# Altium project Accumulator_HotDog_v2.PrjPcb
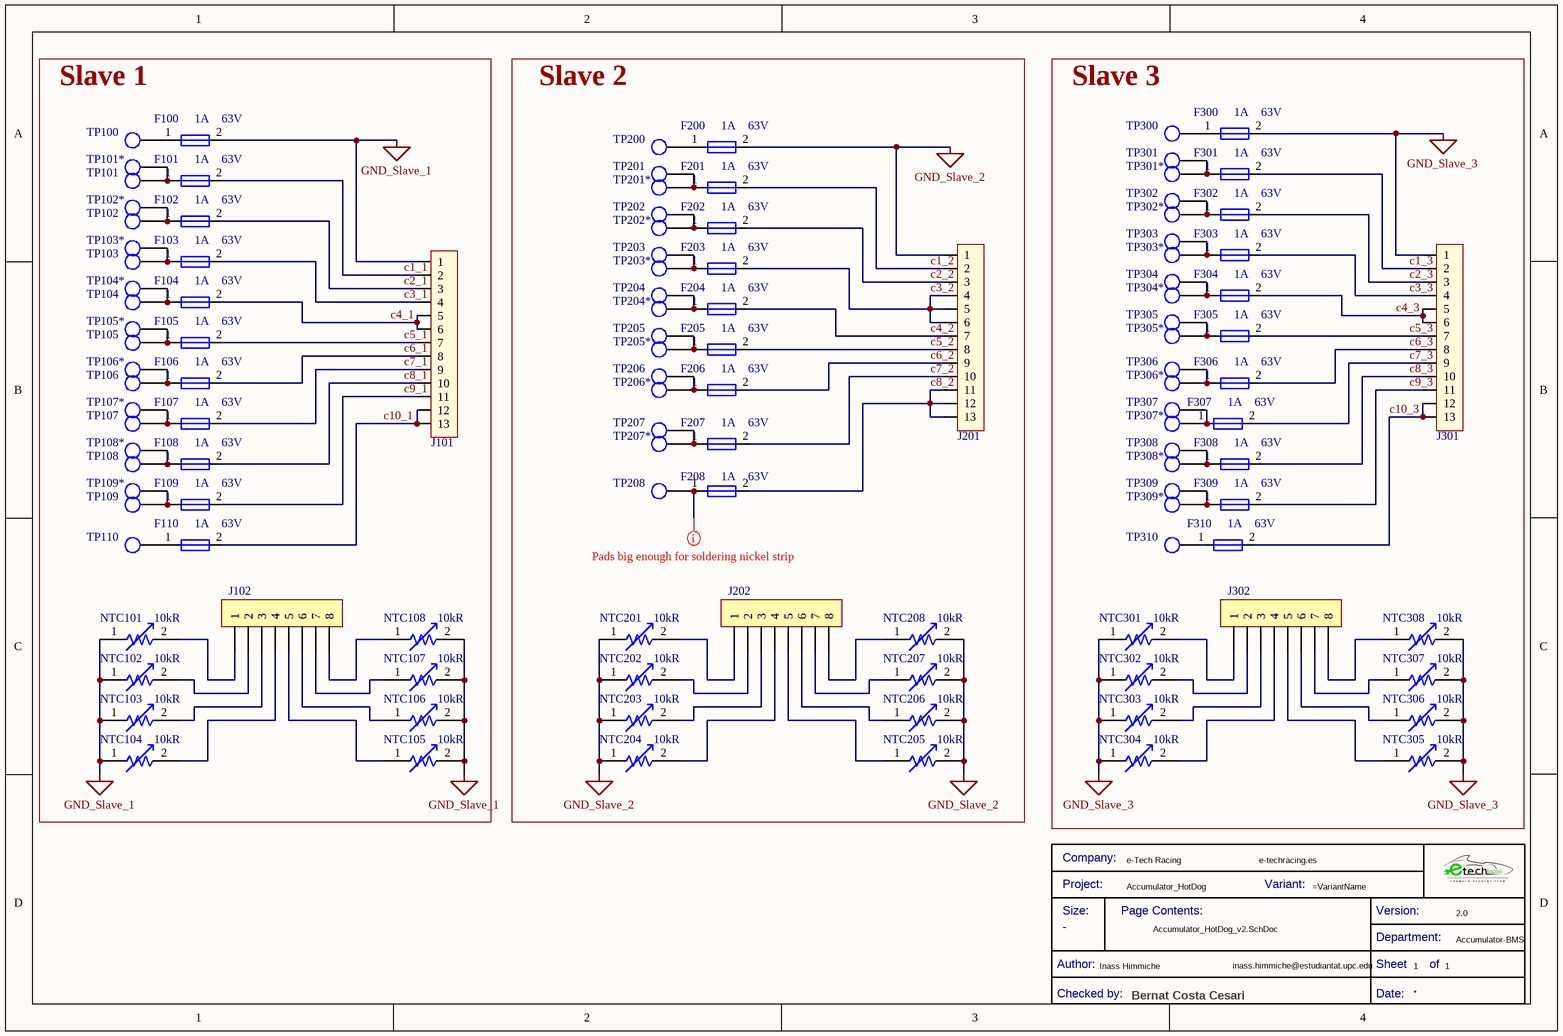
[diagram p0: Accumulator_HotDog_v2.SchDoc]
Version: 2.0; ReviewerName: Bernat Costa Cesari; Project: Accumulator_HotDog; DesignerName: Inass Himmiche; DesignerMail: inass.himmiche@estudiantat.upc.edu; DesignedByURL: e-techracing.es; Department: Accumulator-BMS; Company: e-Tech Racing
1 sheet, 118 parts. Net scope: global (net labels, ports and power ports of the same name join across sheets).
Board file: Accumulator_HotDog_v2.PcbDoc

## Sheet Accumulator_HotDog_v2.SchDoc
size A4; SheetNumber: 1; SheetTotal: 1

### Parts
*  Checked by:: Bernat Costa Cesari  (hidden comment: Title Block_template)  (graphical)
F100  Current Rating: 1A  Voltage Rating (DC): 63V  [Fuse_1206]  (hidden comment: 0437001.WRA)
F101  Current Rating: 1A  Voltage Rating (DC): 63V  [Fuse_1206]  (hidden comment: 0437001.WRA)
F102  Current Rating: 1A  Voltage Rating (DC): 63V  [Fuse_1206]  (hidden comment: 0437001.WRA)
F103  Current Rating: 1A  Voltage Rating (DC): 63V  [Fuse_1206]  (hidden comment: 0437001.WRA)
F104  Current Rating: 1A  Voltage Rating (DC): 63V  [Fuse_1206]  (hidden comment: 0437001.WRA)
F105  Current Rating: 1A  Voltage Rating (DC): 63V  [Fuse_1206]  (hidden comment: 0437001.WRA)
F106  Current Rating: 1A  Voltage Rating (DC): 63V  [Fuse_1206]  (hidden comment: 0437001.WRA)
F107  Current Rating: 1A  Voltage Rating (DC): 63V  [Fuse_1206]  (hidden comment: 0437001.WRA)
F108  Current Rating: 1A  Voltage Rating (DC): 63V  [Fuse_1206]  (hidden comment: 0437001.WRA)
F109  Current Rating: 1A  Voltage Rating (DC): 63V  [Fuse_1206]  (hidden comment: 0437001.WRA)
F110  Current Rating: 1A  Voltage Rating (DC): 63V  [Fuse_1206]  (hidden comment: 0437001.WRA)
F200  Current Rating: 1A  Voltage Rating (DC): 63V  [Fuse_1206]  (hidden comment: 0437001.WRA)
F201  Current Rating: 1A  Voltage Rating (DC): 63V  [Fuse_1206]  (hidden comment: 0437001.WRA)
F202  Current Rating: 1A  Voltage Rating (DC): 63V  [Fuse_1206]  (hidden comment: 0437001.WRA)
F203  Current Rating: 1A  Voltage Rating (DC): 63V  [Fuse_1206]  (hidden comment: 0437001.WRA)
F204  Current Rating: 1A  Voltage Rating (DC): 63V  [Fuse_1206]  (hidden comment: 0437001.WRA)
F205  Current Rating: 1A  Voltage Rating (DC): 63V  [Fuse_1206]  (hidden comment: 0437001.WRA)
F206  Current Rating: 1A  Voltage Rating (DC): 63V  [Fuse_1206]  (hidden comment: 0437001.WRA)
F207  Current Rating: 1A  Voltage Rating (DC): 63V  [Fuse_1206]  (hidden comment: 0437001.WRA)
F208  Current Rating: 1A  Voltage Rating (DC): 63V  [Fuse_1206]  (hidden comment: 0437001.WRA)
F300  Current Rating: 1A  Voltage Rating (DC): 63V  [Fuse_1206]  (hidden comment: 0437001.WRA)
F301  Current Rating: 1A  Voltage Rating (DC): 63V  [Fuse_1206]  (hidden comment: 0437001.WRA)
F302  Current Rating: 1A  Voltage Rating (DC): 63V  [Fuse_1206]  (hidden comment: 0437001.WRA)
F303  Current Rating: 1A  Voltage Rating (DC): 63V  [Fuse_1206]  (hidden comment: 0437001.WRA)
F304  Current Rating: 1A  Voltage Rating (DC): 63V  [Fuse_1206]  (hidden comment: 0437001.WRA)
F305  Current Rating: 1A  Voltage Rating (DC): 63V  [Fuse_1206]  (hidden comment: 0437001.WRA)
F306  Current Rating: 1A  Voltage Rating (DC): 63V  [Fuse_1206]  (hidden comment: 0437001.WRA)
F307  Current Rating: 1A  Voltage Rating (DC): 63V  [Fuse_1206]  (hidden comment: 0437001.WRA)
F308  Current Rating: 1A  Voltage Rating (DC): 63V  [Fuse_1206]  (hidden comment: 0437001.WRA)
F309  Current Rating: 1A  Voltage Rating (DC): 63V  [Fuse_1206]  (hidden comment: 0437001.WRA)
F310  Current Rating: 1A  Voltage Rating (DC): 63V  [Fuse_1206]  (hidden comment: 0437001.WRA)
J101  WR-PHD 13 socket header  [61301311821]  (value not drawn)
J102  J_WR-PHD 8pin Socket Header  [61300811821]  (value not drawn)
J201  WR-PHD 13 socket header  [61301311821]  (value not drawn)
J202  J_WR-PHD 8pin Socket Header  [61300811821]  (value not drawn)
J301  WR-PHD 13 socket header  [61301311821]  (value not drawn)
J302  J_WR-PHD 8pin Socket Header  [61300811821]  (value not drawn)
NTC101  Resistance: 10kR  [NTC_NXRT15XV103FA1B040]  (hidden comment: NXRT15XV103FA1B040)
NTC102  Resistance: 10kR  [NTC_NXRT15XV103FA1B040]  (hidden comment: NXRT15XV103FA1B040)
NTC103  Resistance: 10kR  [NTC_NXRT15XV103FA1B040]  (hidden comment: NXRT15XV103FA1B040)
NTC104  Resistance: 10kR  [NTC_NXRT15XV103FA1B040]  (hidden comment: NXRT15XV103FA1B040)
NTC105  Resistance: 10kR  [NTC_NXRT15XV103FA1B040]  (hidden comment: NXRT15XV103FA1B040)
NTC106  Resistance: 10kR  [NTC_NXRT15XV103FA1B040]  (hidden comment: NXRT15XV103FA1B040)
NTC107  Resistance: 10kR  [NTC_NXRT15XV103FA1B040]  (hidden comment: NXRT15XV103FA1B040)
NTC108  Resistance: 10kR  [NTC_NXRT15XV103FA1B040]  (hidden comment: NXRT15XV103FA1B040)
NTC201  Resistance: 10kR  [NTC_NXRT15XV103FA1B040]  (hidden comment: NXRT15XV103FA1B040)
NTC202  Resistance: 10kR  [NTC_NXRT15XV103FA1B040]  (hidden comment: NXRT15XV103FA1B040)
NTC203  Resistance: 10kR  [NTC_NXRT15XV103FA1B040]  (hidden comment: NXRT15XV103FA1B040)
NTC204  Resistance: 10kR  [NTC_NXRT15XV103FA1B040]  (hidden comment: NXRT15XV103FA1B040)
NTC205  Resistance: 10kR  [NTC_NXRT15XV103FA1B040]  (hidden comment: NXRT15XV103FA1B040)
NTC206  Resistance: 10kR  [NTC_NXRT15XV103FA1B040]  (hidden comment: NXRT15XV103FA1B040)
NTC207  Resistance: 10kR  [NTC_NXRT15XV103FA1B040]  (hidden comment: NXRT15XV103FA1B040)
NTC208  Resistance: 10kR  [NTC_NXRT15XV103FA1B040]  (hidden comment: NXRT15XV103FA1B040)
NTC301  Resistance: 10kR  [NTC_NXRT15XV103FA1B040]  (hidden comment: NXRT15XV103FA1B040)
NTC302  Resistance: 10kR  [NTC_NXRT15XV103FA1B040]  (hidden comment: NXRT15XV103FA1B040)
NTC303  Resistance: 10kR  [NTC_NXRT15XV103FA1B040]  (hidden comment: NXRT15XV103FA1B040)
NTC304  Resistance: 10kR  [NTC_NXRT15XV103FA1B040]  (hidden comment: NXRT15XV103FA1B040)
NTC305  Resistance: 10kR  [NTC_NXRT15XV103FA1B040]  (hidden comment: NXRT15XV103FA1B040)
NTC306  Resistance: 10kR  [NTC_NXRT15XV103FA1B040]  (hidden comment: NXRT15XV103FA1B040)
NTC307  Resistance: 10kR  [NTC_NXRT15XV103FA1B040]  (hidden comment: NXRT15XV103FA1B040)
NTC308  Resistance: 10kR  [NTC_NXRT15XV103FA1B040]  (hidden comment: NXRT15XV103FA1B040)
TP100  TestPoint  [TestPoint]  (value not drawn)  (no BOM)
TP101  TestPoint  [TestPoint]  (value not drawn)  (no BOM)
TP101*  TestPoint  [TestPoint]  (value not drawn)  (no BOM)
TP102  TestPoint  [TestPoint]  (value not drawn)  (no BOM)
TP102*  TestPoint  [TestPoint]  (value not drawn)  (no BOM)
TP103  TestPoint  [TestPoint]  (value not drawn)  (no BOM)
TP103*  TestPoint  [TestPoint]  (value not drawn)  (no BOM)
TP104  TestPoint  [TestPoint]  (value not drawn)  (no BOM)
TP104*  TestPoint  [TestPoint]  (value not drawn)  (no BOM)
TP105  TestPoint  [TestPoint]  (value not drawn)  (no BOM)
TP105*  TestPoint  [TestPoint]  (value not drawn)  (no BOM)
TP106  TestPoint  [TestPoint]  (value not drawn)  (no BOM)
TP106*  TestPoint  [TestPoint]  (value not drawn)  (no BOM)
TP107  TestPoint  [TestPoint]  (value not drawn)  (no BOM)
TP107*  TestPoint  [TestPoint]  (value not drawn)  (no BOM)
TP108  TestPoint  [TestPoint]  (value not drawn)  (no BOM)
TP108*  TestPoint  [TestPoint]  (value not drawn)  (no BOM)
TP109  TestPoint  [TestPoint]  (value not drawn)  (no BOM)
TP109*  TestPoint  [TestPoint]  (value not drawn)  (no BOM)
TP110  TestPoint  [TestPoint]  (value not drawn)  (no BOM)
TP200  TestPoint  [TestPoint]  (value not drawn)  (no BOM)
TP201  TestPoint  [TestPoint]  (value not drawn)  (no BOM)
TP201*  TestPoint  [TestPoint]  (value not drawn)  (no BOM)
TP202  TestPoint  [TestPoint]  (value not drawn)  (no BOM)
TP202*  TestPoint  [TestPoint]  (value not drawn)  (no BOM)
TP203  TestPoint  [TestPoint]  (value not drawn)  (no BOM)
TP203*  TestPoint  [TestPoint]  (value not drawn)  (no BOM)
TP204  TestPoint  [TestPoint]  (value not drawn)  (no BOM)
TP204*  TestPoint  [TestPoint]  (value not drawn)  (no BOM)
TP205  TestPoint  [TestPoint]  (value not drawn)  (no BOM)
TP205*  TestPoint  [TestPoint]  (value not drawn)  (no BOM)
TP206  TestPoint  [TestPoint]  (value not drawn)  (no BOM)
TP206*  TestPoint  [TestPoint]  (value not drawn)  (no BOM)
TP207  TestPoint  [TestPoint]  (value not drawn)  (no BOM)
TP207*  TestPoint  [TestPoint]  (value not drawn)  (no BOM)
TP208  TestPoint  [TestPoint]  (value not drawn)  (no BOM)
TP300  TestPoint  [TestPoint]  (value not drawn)  (no BOM)
TP301  TestPoint  [TestPoint]  (value not drawn)  (no BOM)
TP301*  TestPoint  [TestPoint]  (value not drawn)  (no BOM)
TP302  TestPoint  [TestPoint]  (value not drawn)  (no BOM)
TP302*  TestPoint  [TestPoint]  (value not drawn)  (no BOM)
TP303  TestPoint  [TestPoint]  (value not drawn)  (no BOM)
TP303*  TestPoint  [TestPoint]  (value not drawn)  (no BOM)
TP304  TestPoint  [TestPoint]  (value not drawn)  (no BOM)
TP304*  TestPoint  [TestPoint]  (value not drawn)  (no BOM)
TP305  TestPoint  [TestPoint]  (value not drawn)  (no BOM)
TP305*  TestPoint  [TestPoint]  (value not drawn)  (no BOM)
TP306  TestPoint  [TestPoint]  (value not drawn)  (no BOM)
TP306*  TestPoint  [TestPoint]  (value not drawn)  (no BOM)
TP307  TestPoint  [TestPoint]  (value not drawn)  (no BOM)
TP307*  TestPoint  [TestPoint]  (value not drawn)  (no BOM)
TP308  TestPoint  [TestPoint]  (value not drawn)  (no BOM)
TP308*  TestPoint  [TestPoint]  (value not drawn)  (no BOM)
TP309  TestPoint  [TestPoint]  (value not drawn)  (no BOM)
TP309*  TestPoint  [TestPoint]  (value not drawn)  (no BOM)
TP310  TestPoint  [TestPoint]  (value not drawn)  (no BOM)

### Blocks framed on the sheet
Slave 1: F100-F110 J101 J102 NTC101-NTC108 TP100 TP101 TP101* TP102 TP102* TP103 TP103* TP104 TP104* TP105 TP105* TP106 TP106* TP107 TP107* TP108 TP108* TP109 TP109* TP110
Slave 2: F200-F208 J201 J202 NTC201-NTC208 TP200 TP201 TP201* TP202 TP202* TP203 TP203* TP204 TP204* TP205 TP205* TP206 TP206* TP207 TP207* TP208
Slave 3: F300-F310 J301 J302 NTC301-NTC308 TP300 TP301 TP301* TP302 TP302* TP303 TP303* TP304 TP304* TP305 TP305* TP306 TP306* TP307 TP307* TP308 TP308* TP309 TP309* TP310

### Nets
GND_Slave_1: F100.2 J101.1 NTC101.1 NTC102.1 NTC103.1 NTC104.1 NTC105.2 NTC106.2 NTC107.2 NTC108.2
GND_Slave_2: F200.2 J201.1 NTC201.1 NTC202.1 NTC203.1 NTC204.1 NTC205.2 NTC206.2 NTC207.2 NTC208.2
GND_Slave_3: F300.2 J301.1 NTC301.1 NTC302.1 NTC303.1 NTC304.1 NTC305.2 NTC306.2 NTC307.2 NTC308.2
c1_1: F101.2 J101.2
c1_2: F201.2 J201.2
c1_3: F301.2 J301.2
c2_1: F102.2 J101.3
c2_2: F202.2 J201.3
c2_3: F302.2 J301.3
c3_1: F103.2 J101.4
c3_2: F203.2 J201.4 J201.5 J201.6
c3_3: F303.2 J301.4
c4_1: F104.2 J101.5 J101.6
c4_2: F204.2 J201.7
c4_3: F304.2 J301.5 J301.6
c5_1: F105.2 J101.7
c5_2: F205.2 J201.8
c5_3: F305.2 J301.7
c6_1: F106.2 J101.8
c6_2: F206.2 J201.9
c6_3: F306.2 J301.8
c7_1: F107.2 J101.9
c7_2: F207.2 J201.10
c7_3: F307.2 J301.9
c8_1: F108.2 J101.10
c8_2: F208.2 J201.11 J201.12 J201.13
c8_3: F308.2 J301.10
c9_1: F109.2 J101.11
c9_3: F309.2 J301.11
c10_1: F110.2 J101.12 J101.13
c10_3: F310.2 J301.12 J301.13
NetF100_1: F100.1 TP100.1
NetF101_1: F101.1 TP101.1 TP101*.1
NetF102_1: F102.1 TP102.1 TP102*.1
NetF103_1: F103.1 TP103.1 TP103*.1
NetF104_1: F104.1 TP104.1 TP104*.1
NetF105_1: F105.1 TP105.1 TP105*.1
NetF106_1: F106.1 TP106.1 TP106*.1
NetF107_1: F107.1 TP107.1 TP107*.1
NetF108_1: F108.1 TP108.1 TP108*.1
NetF109_1: F109.1 TP109.1 TP109*.1
NetF110_1: F110.1 TP110.1
NetF200_1: F200.1 TP200.1
NetF201_1: F201.1 TP201.1 TP201*.1
NetF202_1: F202.1 TP202.1 TP202*.1
NetF203_1: F203.1 TP203.1 TP203*.1
NetF204_1: F204.1 TP204.1 TP204*.1
NetF205_1: F205.1 TP205.1 TP205*.1
NetF206_1: F206.1 TP206.1 TP206*.1
NetF207_1: F207.1 TP207.1 TP207*.1
NetF208_1: F208.1 TP208.1
NetF300_1: F300.1 TP300.1
NetF301_1: F301.1 TP301.1 TP301*.1
NetF302_1: F302.1 TP302.1 TP302*.1
NetF303_1: F303.1 TP303.1 TP303*.1
NetF304_1: F304.1 TP304.1 TP304*.1
NetF305_1: F305.1 TP305.1 TP305*.1
NetF306_1: F306.1 TP306.1 TP306*.1
NetF307_1: F307.1 TP307.1 TP307*.1
NetF308_1: F308.1 TP308.1 TP308*.1
NetF309_1: F309.1 TP309.1 TP309*.1
NetF310_1: F310.1 TP310.1
NetJ102_1: J102.1 NTC101.2
NetJ102_2: J102.2 NTC102.2
NetJ102_3: J102.3 NTC103.2
NetJ102_4: J102.4 NTC104.2
NetJ102_5: J102.5 NTC105.1
NetJ102_6: J102.6 NTC106.1
NetJ102_7: J102.7 NTC107.1
NetJ102_8: J102.8 NTC108.1
NetJ202_1: J202.1 NTC201.2
NetJ202_2: J202.2 NTC202.2
NetJ202_3: J202.3 NTC203.2
NetJ202_4: J202.4 NTC204.2
NetJ202_5: J202.5 NTC205.1
NetJ202_6: J202.6 NTC206.1
NetJ202_7: J202.7 NTC207.1
NetJ202_8: J202.8 NTC208.1
NetJ302_1: J302.1 NTC301.2
NetJ302_2: J302.2 NTC302.2
NetJ302_3: J302.3 NTC303.2
NetJ302_4: J302.4 NTC304.2
NetJ302_5: J302.5 NTC305.1
NetJ302_6: J302.6 NTC306.1
NetJ302_7: J302.7 NTC307.1
NetJ302_8: J302.8 NTC308.1

### Layout directives
mark named Pads big enough for soldering nickel strip: NetF208_1

### Notes on the sheet
- (in symbol Title Block_template) Company:; Project:; Variant:; Size:; Page Contents:; Version:; Department:; Author:; Sheet; of; Checked by:; Date:

### Library data of the parts
* = Title Block_template: Standard Title Block; Category: Title Block; Size: -
F100-F110 F200-F208 F300-F310 = Fuse_1A_63V_1206: Fuse Chip Fast Acting 1A 63V SMD Solder Pad 1206 Ceramic T/R Automotive; Manufacturer: Littelfuse; Fuse Type: Board Mount (Cartridge Style Excluded); Approvals: CSA,cURus; Supplier 1: Digi-Key; Manufacturer Part Number: 0437001.WRA; RoHS: Yes; Category: Fuses; Stock 1: 5820; Pricing 1: 1=1,52000, 5=1,47000, 10=1,37600, 50=1,13860, 100=0,94880, 250=0,92508, 500=0,78276, 1000=0,68788 (USD); Mount: Surface Mount; Case/Package: 1206; Case Code (Imperial): 1206; Case Code (Metric): 3216; Min Operating Temperature: -55°C; Max Operating Temperature: 150°C; Packaging: Tape and Reel; Voltage Rating (AC): 63V; ComponentLink1URL: https://www.littelfuse.com/~/media/electronics/datasheets/fuses/littelfuse_fuse_437a_datasheet.pdf.pdf?src-supplier=Digi-Key; ComponentLink1Description: https://www.littelfuse.com/~/media/electronics/datasheets/fuses/littelfuse_fuse_437a_datasheet.pdf.pdf?src-supplier=Digi-Key; Supplier Part Number 1: F10001CT-ND; ComponentLink2Description: Where buy it; ComponentLink2URL: https://www.mouser.es/ProductDetail/Littelfuse/0437001WRA?qs=DXv0QSHKF4z9CJhPXjxR%252BA%3D%3D
J101 J201 J301 = J_WR-PHD 13pin Socket Header: 13 pin Socket Header 61301311821; ComponentLink1Description: Datasheet; ComponentLink1URL: https://www.we-online.com/components/products/datasheet/61301311821.pdf
J102 J202 J302 = J_WR-PHD 8pin Socket Header: 8pin Socket Header 2.54 mm; Supplier 1: Digi-Key; Supplier Part Number 1: 732-61300811821-ND
NTC101-NTC108 NTC201-NTC208 NTC301-NTC308 = NTC_NXRT15XV103FA1B040: NXR Series 10 kOhm 3900 K ±1% Bead NTC Thermistor Sensor; Manufacturer 1: Murata; Power Rating: 7.5mW; Lead Diameter: 0.4mm; Supplier 1: Digi-Key; Manufacturer Part Number 1: NXRT15XV103FA1B040; RoHS: Yes; Category: Thermistors; Stock 1: 38458; Pricing 1: 1=0,63000, 5=0,60000, 10=0,52300, 25=0,45920, 50=0,38140, 100=0,32490, 500=0,28248, 1000=0,24717, 5000=0,21892 (USD); Mount: Through Hole; Number of Pins: 2; Min Operating Temperature: -40°C; Max Operating Temperature: 125°C; Packaging: Bulk; Termination: Radial; Tolerance: 1%; Package Quantity: 500; Series: NXR; Resistance Tolerance: 1%; Max Power Dissipation: 7.5mW; Length: 5mm; Width: 4mm; Height: 2mm; Lead Pitch: 2.5mm; Lead Free: Lead Free; RoHS Compliant: No; ComponentLink1URL: http://www.mouser.com/ds/2/281/r44e-3685.pdf?src-supplier=Mouser; ComponentLink1Description: http://www.mouser.com/ds/2/281/r44e-3685.pdf?src-supplier=Mouser; ComponentLink2URL: https://www.murata.com/en-us/products/productdata/8796838297630/S0423E.pdf?src-supplier=Digi-Key; ComponentLink2Description: https://www.murata.com/en-us/products/productdata/8796838297630/S0423E.pdf?src-supplier=Digi-Key; ComponentLink3URL: http://www.murata.com/~/media/webrenewal/support/library/catalog/products/thermistor/ntc/r44e.ashx?src-supplier=Avnet; ComponentLink3Description: http://www.murata.com/~/media/webrenewal/support/library/catalog/products/thermistor/ntc/r44e.ashx?src-supplier=Avnet; Supplier Part Number 1: 490-7171-ND
TP100 TP101 TP101* TP102 TP102* TP103 TP103* TP104 TP104* TP105 TP105* TP106 TP106* TP107 TP107* TP108 TP108* TP109 TP109* TP110 TP200 TP201 TP201* TP202 TP202* TP203 TP203* TP204 TP204* TP205 TP205* TP206 TP206* TP207 TP207* TP208 TP300 TP301 TP301* TP302 TP302* TP303 TP303* TP304 TP304* TP305 TP305* TP306 TP306* TP307 TP307* TP308 TP308* TP309 TP309* TP310 = TestPoint: Test Point 1x1 mm; Category: TestPoint